# Altium schematic sheet UEEE_READ_FRID_V1.1.SchDoc
size A2
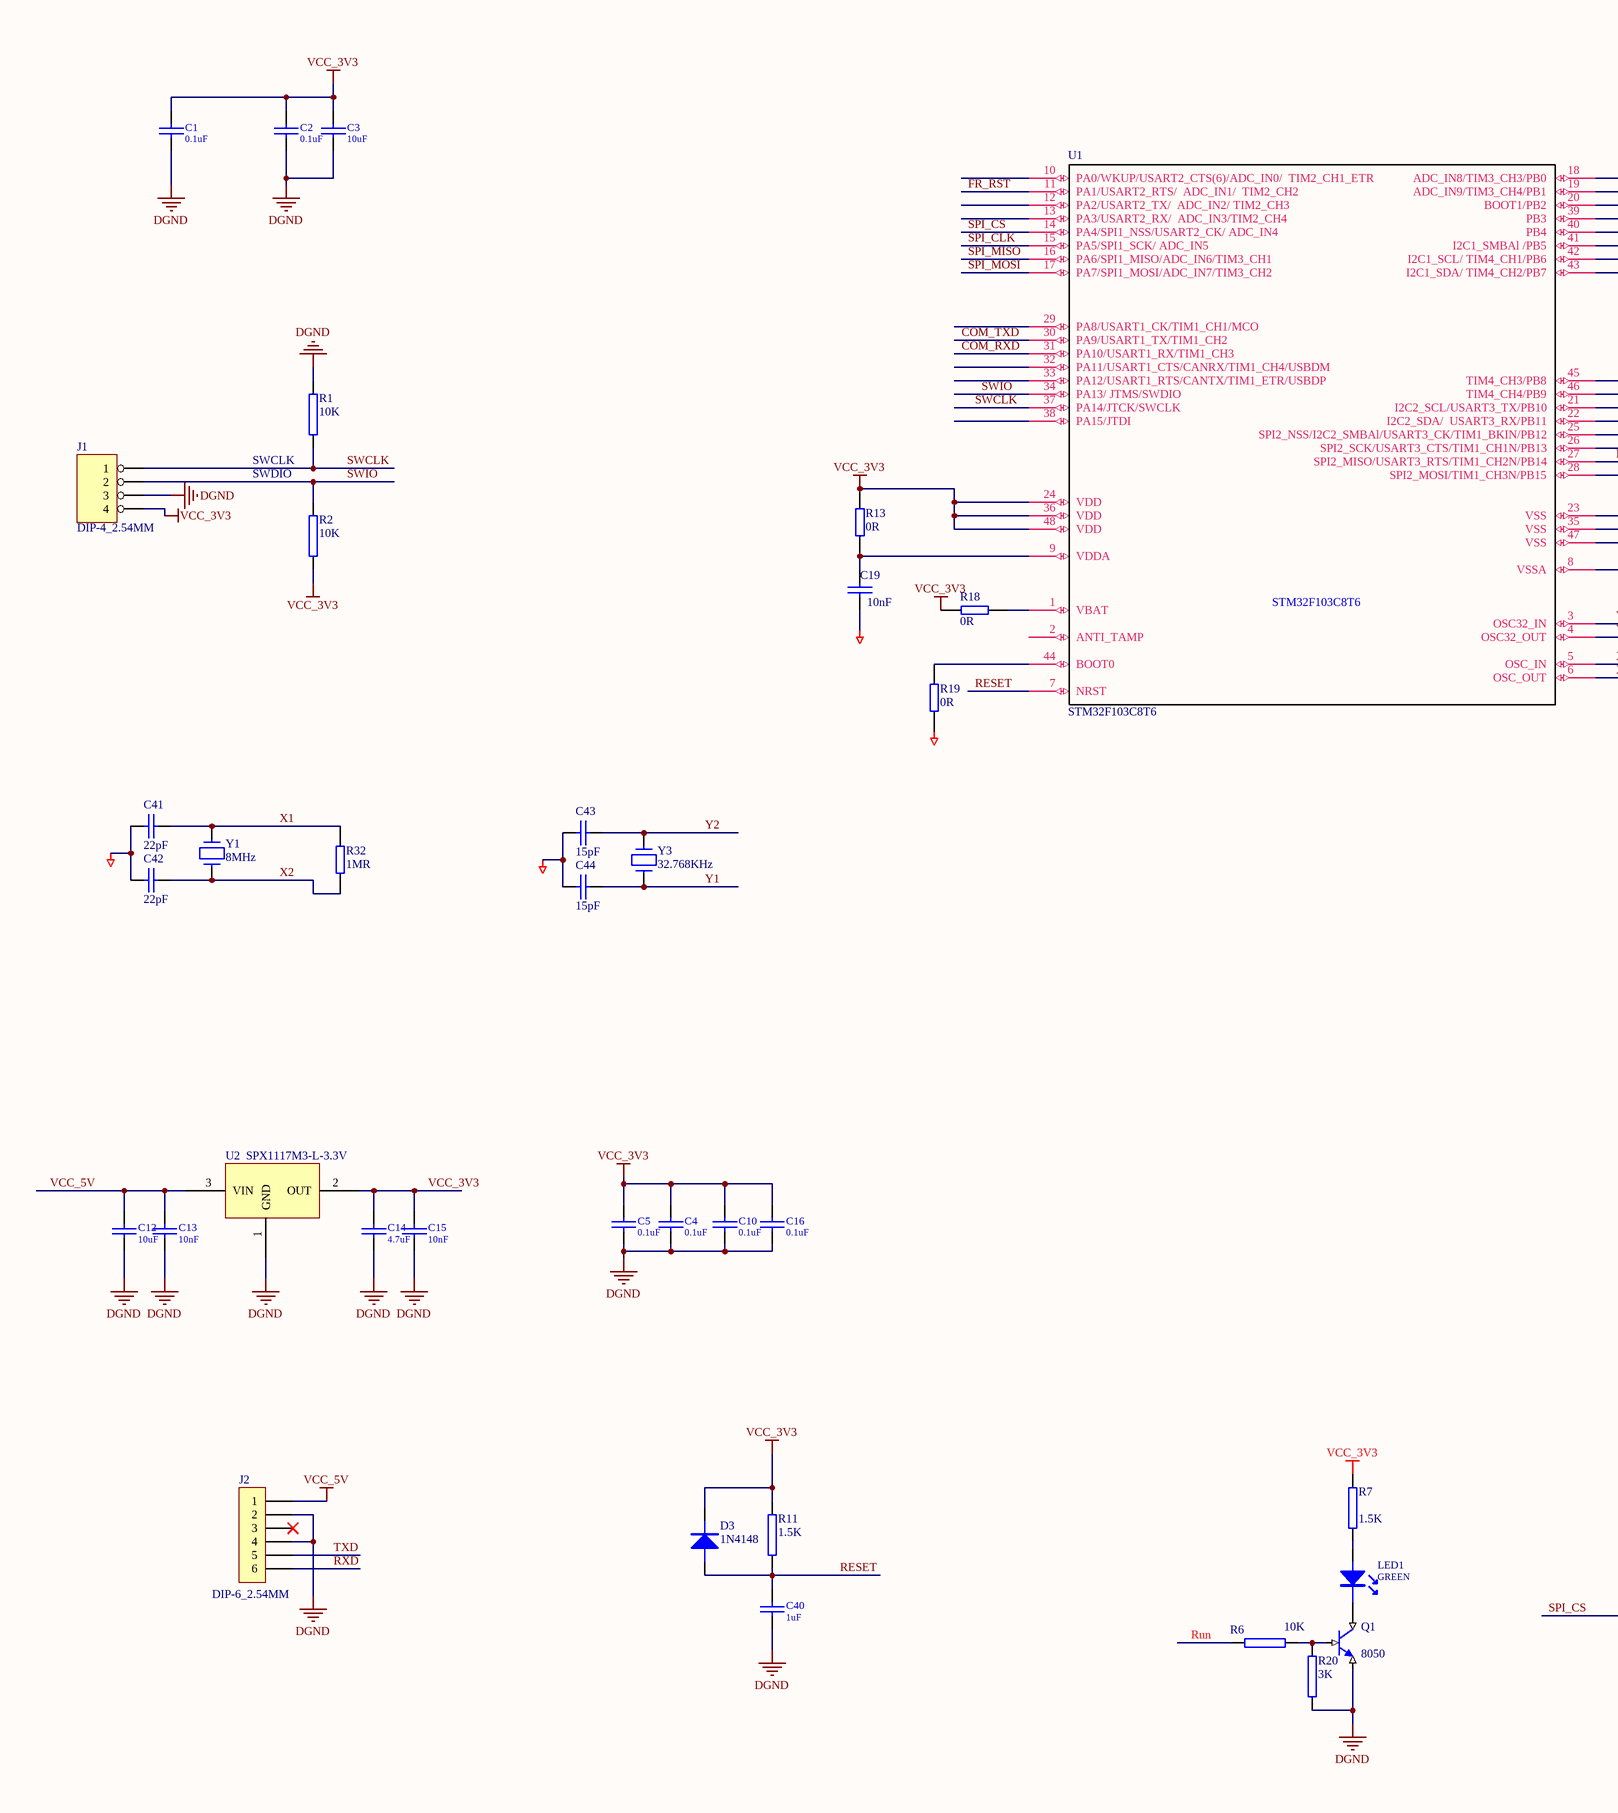
[diagram p0: UEEE_READ_FRID_V1.1.SchDoc, left]
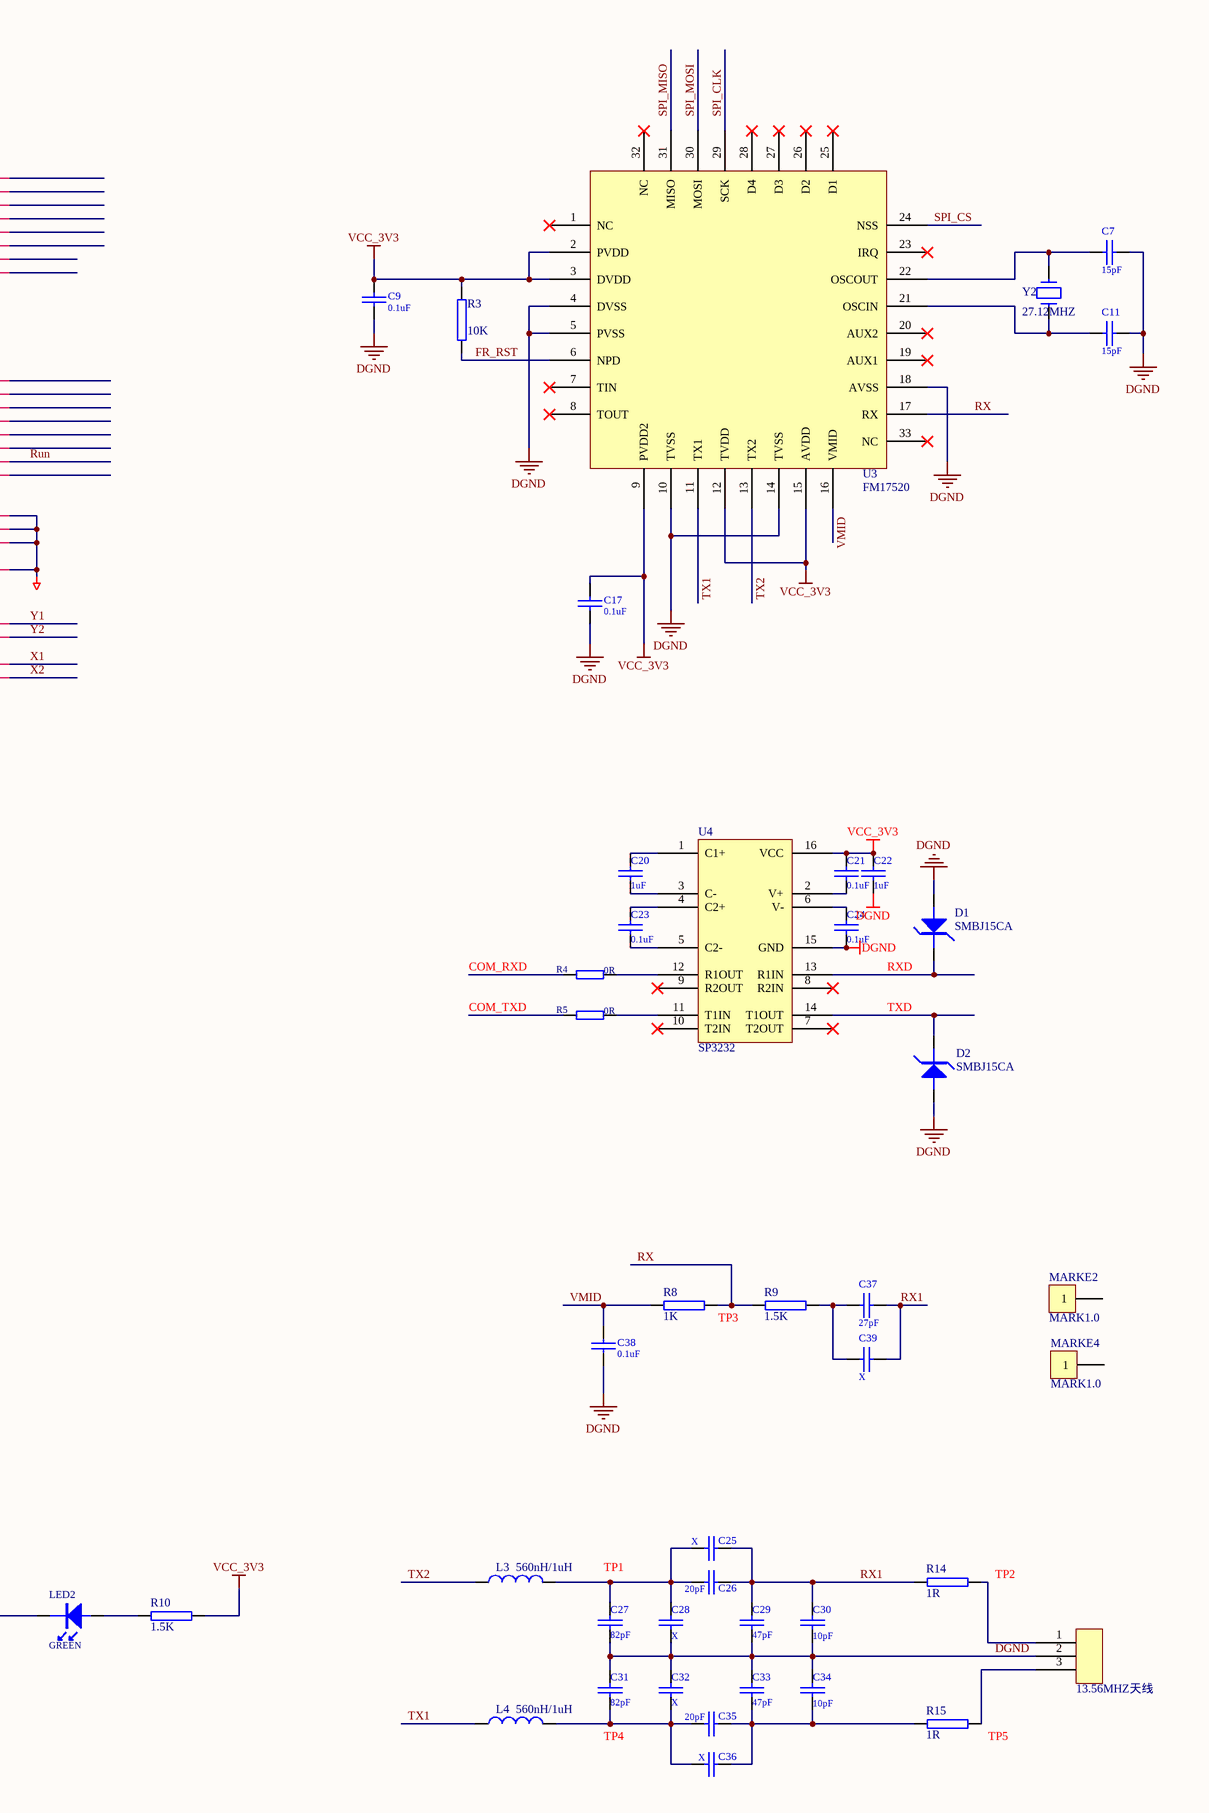
[diagram p1: UEEE_READ_FRID_V1.1.SchDoc, right]

## Parts
?  13.56MHZ天线  [天线40X50MM]
C1  0.1uF  [0603C]
C2  0.1uF  [0603C]
C3  10uF  [0805C]
C4  0.1uF  [0603C]
C5  0.1uF  [0603C]
C7  15pF  [0603C]
C9  0.1uF  [0603C]
C10  0.1uF  [0603C]
C11  15pF  [0603C]
C12  10uF  [0805C]
C13  10nF  [0603C]
C14  4.7uF  [0805C]
C15  10nF  [0603C]
C16  0.1uF  [0603C]
C17  0.1uF  [0603C]
C19  10nF  [0603C]
C20  1uF  [0603C]
C21  0.1uF  [0603C]
C22  1uF  [0603C]
C23  0.1uF  [0603C]
C24  0.1uF  [0603C]
C25  X  [0603C]
C26  20pF  [0603C]
C27  82pF  [0603C]
C28  X  [0603C]
C29  47pF  [0603C]
C30  10pF  [0603C]
C31  82pF  [0603C]
C32  X  [0603C]
C33  47pF  [0603C]
C34  10pF  [0603C]
C35  20pF  [0603C]
C36  X  [0603C]
C37  27pF  [0603C]
C38  0.1uF  [0603C]
C39  X  [0603C]
C40  1uF  [0603C]
C41  22pF  [0603C]
C42  22pF  [0603C]
C43  15pF  [0603C]
C44  15pF  [0603C]
D1  SMBJ15CA  [SMB（DO-214AA）]
D2  SMBJ15CA  [SMB（DO-214AA）]
D3  1N4148  [1206D]
J1  DIP-4_2.54MM  [CON-DIP4-2.54mm]
J2  DIP-6_2.54MM  [CON06_2.54]
L3  560nH/1uH  [3225 [1210 inch]]
L4  560nH/1uH  [3225 [1210 inch]]
LED1  GREEN  [D0805]
LED2  GREEN  [D0805]
MARKE2  MARK1.0  [MARK1.0]
MARKE4  MARK1.0  [MARK1.0]
Q1  8050  [SOT23]
R1  10K  [0603R]
R2  10K  [0603R]
R3  10K  [0603R]
R4  0R  [0603R]
R5  0R  [0603R]
R6  10K  [0603R]
R7  1.5K  [0603R]
R8  1K  [0603R]
R9  1.5K  [0603R]
R10  1.5K  [0603R]
R11  1.5K  [0603R]
R13  0R  [0603R]
R14  1R  [0603R]
R15  1R  [0603R]
R18  0R  [0603R]
R19  0R  [0603R]
R20  3K  [0603R]
R32  1MR  [0603R]
U1  STM32F103C8T6  [LQFP48_N]
U2  SPX1117M3-L-3.3V  [SOT-223]
U3  FM17520  [QFN-32]
U4  SP3232  [SO-16]
Y1  8MHz  [ZS_SMD]
Y2  27.12MHZ  [ZS_SMD]
Y3  32.768KHz  [ZS-32.768]

## Nets
DGND: ?.2 C1.2 C2.2 C3.2 C4.2 C5.2 C7.1 C9.1 C10.2 C11.1 C12.1 C13.1 C14.1 C15.1 C16.2 C17.1 C19.2 C22.1 C24.1 C27.1 C28.1 C29.1 C30.1 C31.2 C32.2 C33.2 C34.2 C38.2 C40.2 C41.1 C42.1 C43.1 C44.1 D1.1 D2.1 J1.3 J2.2 J2.4 Q1.3(E) R1.2 R19.1 R20.1 U1.8(VSSA) U1.23(VSS) U1.35(VSS) U1.47(VSS) U2.1(GND) U3.4(DVSS) U3.5(PVSS) U3.10(TVSS) U3.14(TVSS) U3.18(AVSS) U4.15(GND)
VCC_3V3: C1.1 C2.1 C3.1 C4.1 C5.1 C9.2 C10.1 C14.2 C15.2 C16.1 C17.2 C21.2 C22.2 D3.2(K) J1.4 R2.1 R3.2 R7.2 R10.1 R11.2 R13.1 R18.2 U1.24(VDD) U1.36(VDD) U1.48(VDD) U2.2(OUT) U3.2(PVDD) U3.3(DVDD) U3.9(PVDD2) U3.12(TVDD) U3.15(AVDD) U4.16(VCC)
VCC_5V: C12.2 C13.2 J2.1 U2.3(VIN)
COM_RXD: R4.1 U1.31(PA10/USART1_RX/TIM1_CH3)
COM_TXD: R5.1 U1.30(PA9/USART1_TX/TIM1_CH2)
FR_RST: R3.1 U1.11(PA1/USART2_RTS/__ADC_IN1/__TIM2_CH2) U3.6(NPD)
RESET: C40.1 D3.1(A) R11.1 U1.7(NRST)
Run: R6.1 U1.27(SPI2_MISO/USART3_RTS/TIM1_CH2N/PB14)
RX: R8.2 R9.1 U3.17(RX)
RX1: C25.1 C26.1 C29.2 C30.2 C37.2 C39.2 R14.1
RXD: D1.2 J2.6 U4.13(R1IN)
SPI_CLK: U1.15(PA5/SPI1_SCK/_ADC_IN5) U3.29(SCK)
SPI_CS: LED2.2 U1.14(PA4/SPI1_NSS/USART2_CK/_ADC_IN4) U3.24(NSS)
SPI_MISO: U1.16(PA6/SPI1_MISO/ADC_IN6/TIM3_CH1) U3.31(MISO)
SPI_MOSI: U1.17(PA7/SPI1_MOSI/ADC_IN7/TIM3_CH2) U3.30(MOSI)
SWCLK: J1.1 R1.1 U1.37(PA14/JTCK/SWCLK)
SWIO: J1.2 R2.2 U1.34(PA13/_JTMS/SWDIO)
TX1: L4.1 U3.11(TX1)
TX2: L3.1 U3.13(TX2)
TXD: D2.2 J2.5 U4.14(T1OUT)
VMID: C38.1 R8.1 U3.16(VMID)
X1: C41.2 R32.1 U1.5(OSC_IN) Y1.2
X2: C42.2 R32.2 U1.6(OSC_OUT) Y1.1
Y1: C44.2 U1.3(OSC32_IN) Y3.1
Y2: C43.2 U1.4(OSC32_OUT) Y3.2
Net?_1: ?.1 R14.2
Net?_3: ?.3 R15.2
NetC7_2: C7.2 U3.22(OSCOUT) Y2.2
NetC11_2: C11.2 U3.21(OSCIN) Y2.1
NetC19_1: C19.1 R13.2 U1.9(VDDA)
NetC20_1: C20.1 U4.3(C-)
NetC20_2: C20.2 U4.1(C1+)
NetC21_1: C21.1 U4.2(V+)
NetC23_1: C23.1 U4.5(C2-)
NetC23_2: C23.2 U4.4(C2+)
NetC24_2: C24.2 U4.6(V-)
NetC25_2: C25.2 C26.2 C27.2 C28.2 L3.2
NetC31_1: C31.1 C32.1 C35.2 C36.2 L4.2
NetC33_1: C33.1 C34.1 C35.1 C36.1 R15.1
NetC37_1: C37.1 C39.1 R9.2
NetLED1_1: LED1.1 R7.1
NetLED1_2: LED1.2 Q1.2(C)
NetLED2_1: LED2.1 R10.2
NetQ1_1: Q1.1(B) R6.2 R20.2
NetR4_2: R4.2 U4.12(R1OUT)
NetR5_2: R5.2 U4.11(T1IN)
NetR18_1: R18.1 U1.1(VBAT)
NetR19_2: R19.2 U1.44(BOOT0)

Not connected (* = marked no-connect by the designer): J2 3*; MARKE2 1; MARKE4 1; U1 2(ANTI_TAMP) 10(PA0/WKUP/USART2_CTS(6)/ADC_IN0/__TIM2_CH1_ETR) 12(PA2/USART2_TX/__ADC_IN2/_TIM2_CH3) 13(PA3/USART2_RX/__ADC_IN3/TIM2_CH4) 18(ADC_IN8/TIM3_CH3/PB0) 19(ADC_IN9/TIM3_CH4/PB1) 20(BOOT1/PB2) 21(I2C2_SCL/USART3_TX/PB10) 22(I2C2_SDA/__USART3_RX/PB11) 25(SPI2_NSS/I2C2_SMBAl/USART3_CK/TIM1_BKIN/PB12) 26(SPI2_SCK/USART3_CTS/TIM1_CH1N/PB13) 28(SPI2_MOSI/TIM1_CH3N/PB15) 29(PA8/USART1_CK/TIM1_CH1/MCO) 32(PA11/USART1_CTS/CANRX/TIM1_CH4/USBDM) 33(PA12/USART1_RTS/CANTX/TIM1_ETR/USBDP) 38(PA15/JTDI) 39(PB3) 40(PB4) 41(I2C1_SMBAl_/PB5) 42(I2C1_SCL/_TIM4_CH1/PB6) 43(I2C1_SDA/_TIM4_CH2/PB7) 45(TIM4_CH3/PB8) 46(TIM4_CH4/PB9); U3 1(NC)* 7(TIN)* 8(TOUT)* 19(AUX1)* 20(AUX2)* 23(IRQ)* 25(D1)* 26(D2)* 27(D3)* 28(D4)* 32(NC)* 33(NC)*; U4 7(T2OUT)* 8(R2IN)* 9(R2OUT)* 10(T2IN)*

## Notes on the sheet
- SWCLK
- SWDIO
- (near R8) TP3
- TP1
- (near R14) TP2
- (near C31) TP4
- (near R15) TP5

## Library data of the parts
C1-C5 C10 C16 = CAP_3: Capacitor
C7 C9 C11-C15 C17 C20-C40 = CAP: Capacitor
C19 C42 C44 = CAP1: 0603贴片电容/50V/0.1uF/±10%/X7R
C41 C43 = CAP1: 0603贴片电容/50V/1uF/±10%/X7R
D1 D2 = TVS-D
D3 = DIODE: 贴片二极管/1N4148/LL34/长电
J1 = 4 HEADER: 4 Pin Header
J2 = CON6: Connector
L3 L4 = INDUCTOR: NLV32T-R56J-PF/NLV32T-1R0J-PF
LED1 LED2 = LED
MARKE2 MARKE4 = CON1: Connector
Q1 = NPN
R1 R2 R14 R15 = RES2
R3 R6-R11 R13 R18-R20 R32 = RES1
R4 R5 = RES-1: RES
U2 = LM1117MPX-3.3
U4 = MAX232ESE
Y1 Y3 = CRYSTAL: 32.768KHz晶振/圆柱形/2*6mm
Y2 = CRYSTAL